# Altium schematic sheet DA1470x-SmartWatch.SchDoc: DA1470x-SmartWatch
size A3; Organization: Altium Limited; Address1: L3, 12a Rodborough Rd; Address2: Frenchs Forest; Address3: NSW; Address4: Australia 2086; SheetNumber: 1; SheetTotal: 7; SheetSize: A3
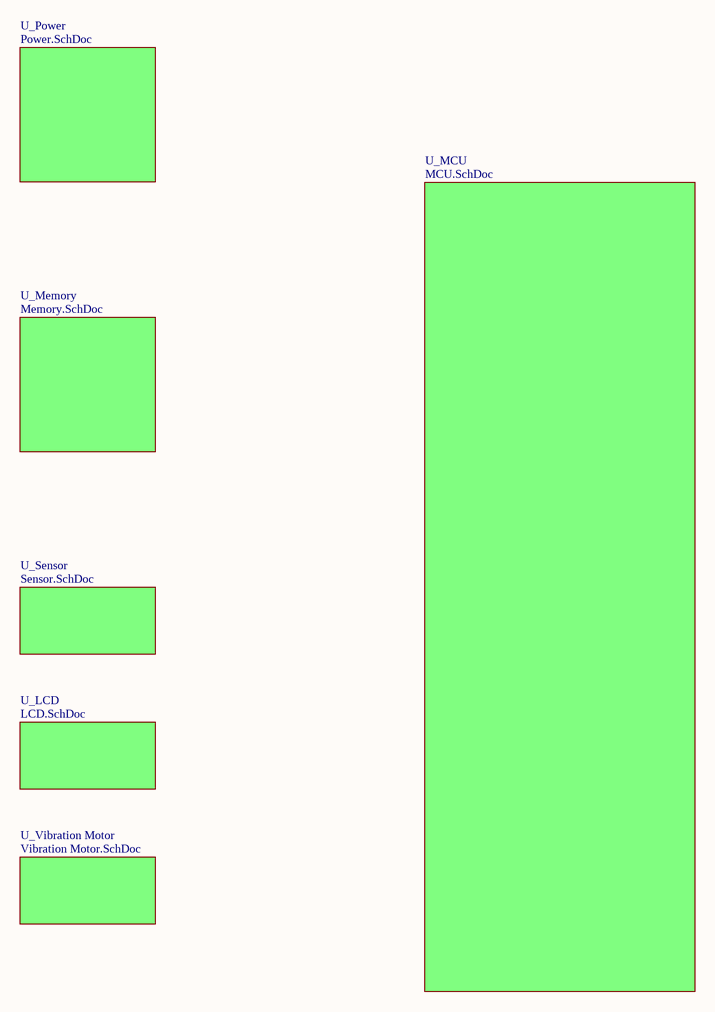
[diagram p0: DA1470x-SmartWatch.SchDoc]

## Sub-sheets
U_LCD = LCD.SchDoc: no entries
U_MCU = MCU.SchDoc: no entries
U_Memory = Memory.SchDoc: no entries
U_Power = Power.SchDoc: no entries
U_Sensor = Sensor.SchDoc: no entries
U_Vibration Motor = Vibration Motor.SchDoc: no entries

## Notes on the sheet
- Title:
- Size:
- Project:
- Revision:
- Sheet
- of
- Date:
- YıLDıZ IoT
- Elperek Mahallesi
- Saray Sokak, No:12
- SAKARYA / TURKEY
- File: